# EAGLE schematic core (EAGLE 7.1.0)
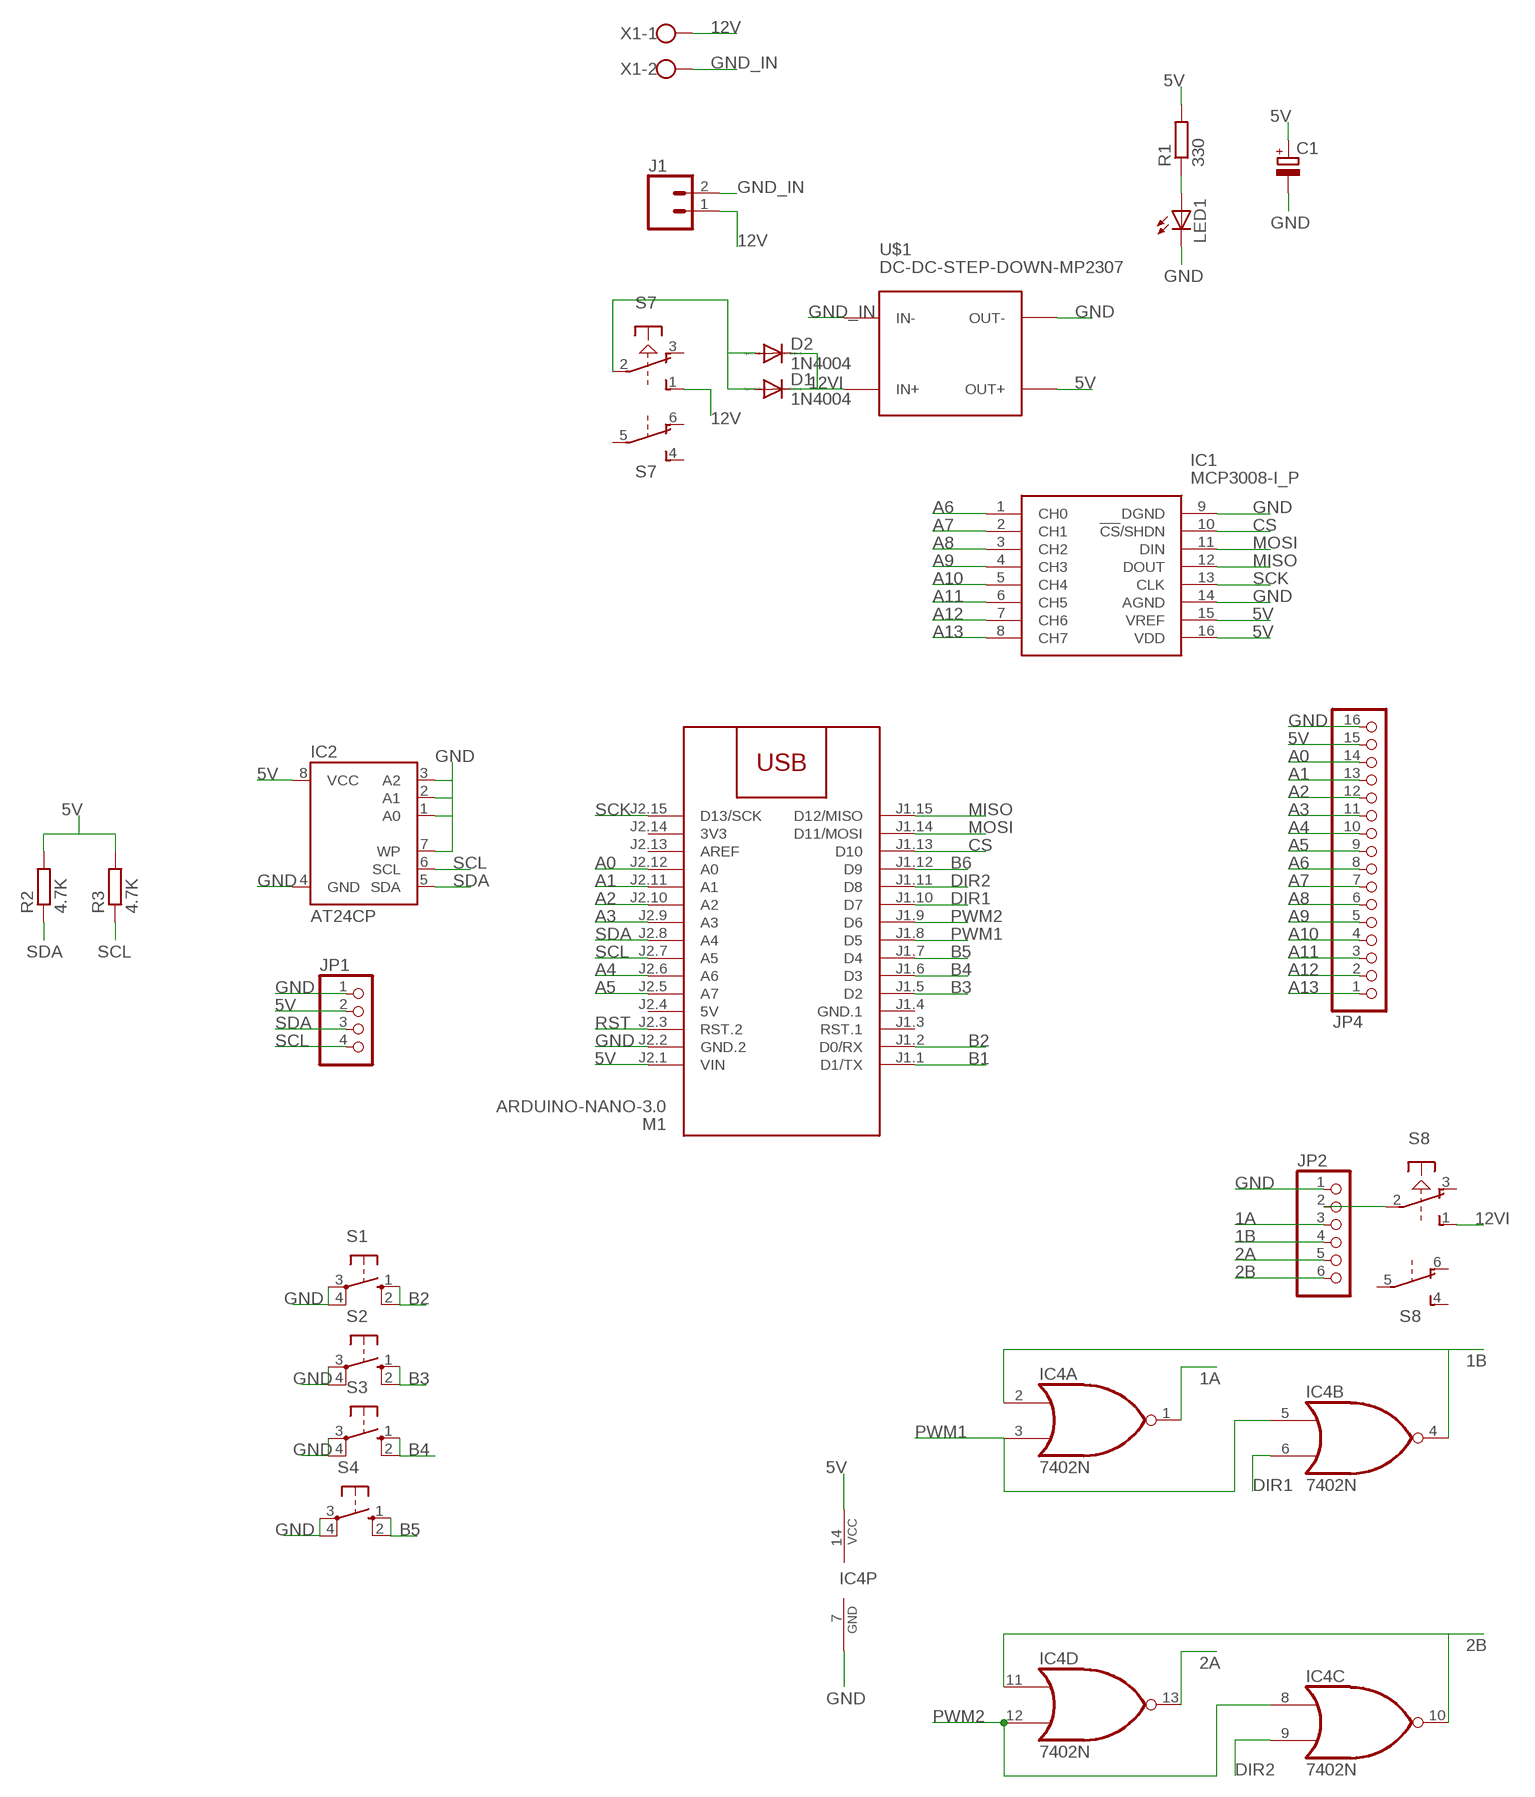
[diagram p0: schematic, sheet 1]

## Parts
C1  CPOL-EUE2.5-6  [E2,5-6]
D1  1N4004  [DO41-10]
D2  1N4004  [DO41-10]
IC1  MCP3008-I_P  [DIP781W56P254L1918H533Q16N]
IC2  AT24CP  [DIL08]
IC4  7402N  [DIL14]
J1  CONN_02POLAR  [MOLEX-1X2]
JP1  PINHD-1X4  [1X04]
JP2  PINHD-1X6  [1X06]
JP4  PINHD-1X16  [1X16]
LED1  LED3MM  [LED3MM]
M1  ARDUINO-NANO-3.0  [ARDUINO-NANO-3.0]
R1  330  R-EU_0207/7  [0207/7]
R2  4.7K  R-EU_0207/7  [0207/7]
R3  4.7K  R-EU_0207/7  [0207/7]
S1  10-XX  [B3F-10XX]
S2  10-XX  [B3F-10XX]
S3  10-XX  [B3F-10XX]
S4  10-XX  [B3F-10XX]
S7  PVA2R  [PVA2R]
S8  PVA2R  [PVA2R]
U$1  DC-DC-STEP-DOWN-MP2307  [DC-DC-STEP-DOWN-MP2307]
X1  W237-102  [W237-102]

## Nets
1A: IC4.1(A:O) JP2.3
1B: IC4.2(A:I0) IC4.4(B:O) JP2.4
2A: IC4.13(D:O) JP2.5
2B: IC4.10(C:O) IC4.11(D:I0) JP2.6
5V: C1.+ IC1.15(VREF) IC1.16(VDD) IC2.8(VCC) IC4.14(P:VCC) JP1.2 JP4.15 M1.J2.1(VIN) R1.2 R2.2 R3.2 U$1.OUT+
12V: J1.1 S7.1(1:S) X1.1
12VI: D1.C D2.C S8.1(1:S) U$1.IN+
A0: JP4.14 M1.J2.12(A0)
A1: JP4.13 M1.J2.11(A1)
A2: JP4.12 M1.J2.10(A2)
A3: JP4.11 M1.J2.9(A3)
A4: JP4.10 M1.J2.6(A6)
A5: JP4.9 M1.J2.5(A7)
A6: IC1.1(CH0) JP4.8
A7: IC1.2(CH1) JP4.7
A8: IC1.3(CH2) JP4.6
A9: IC1.4(CH3) JP4.5
A10: IC1.5(CH4) JP4.4
A11: IC1.6(CH5) JP4.3
A12: IC1.7(CH6) JP4.2
A13: IC1.8(CH7) JP4.1
B1: M1.J1.1(D1/TX)
B2: M1.J1.2(D0/RX) S1.1(S) S1.2(S1)
B3: M1.J1.5(D2) S2.1(S) S2.2(S1)
B4: M1.J1.6(D3) S3.1(S) S3.2(S1)
B5: M1.J1.7(D4) S4.1(S) S4.2(S1)
B6: M1.J1.12(D9)
CS: IC1.10(!CS!/SHDN) M1.J1.13(D10)
DIR1: IC4.6(B:I1) M1.J1.10(D7)
DIR2: IC4.9(C:I1) M1.J1.11(D8)
GND: C1.- IC1.9(DGND) IC1.14(AGND) IC2.1(A0) IC2.2(A1) IC2.3(A2) IC2.4(GND) IC2.7(WP) IC4.7(P:GND) JP1.1 JP2.1 JP4.16 LED1.K(C) M1.J2.2(GND.2) S1.3(P) S1.4(P1) S2.3(P) S2.4(P1) S3.3(P) S3.4(P1) S4.3(P) S4.4(P1) U$1.OUT-
GND_IN: J1.2 U$1.IN- X1.2
MISO: IC1.12(DOUT) M1.J1.15(D12/MISO)
MOSI: IC1.11(DIN) M1.J1.14(D11/MOSI)
N$1: D1.A D2.A S7.2(1:P)
N$2: LED1.A R1.1
N$4: JP2.2 S8.2(1:P)
PWM1: IC4.3(A:I1) IC4.5(B:I0) M1.J1.8(D5)
PWM2: IC4.8(C:I0) IC4.12(D:I1) M1.J1.9(D6)
RST: M1.J2.3(RST.2)
SCK: IC1.13(CLK) M1.J2.15(D13/SCK)
SCL: IC2.6(SCL) JP1.4 M1.J2.7(A5) R3.1
SDA: IC2.5(SDA) JP1.3 M1.J2.8(A4) R2.1
Unconnected: M1.J1.3(RST.1) M1.J2.13(AREF) S7.3(1:O) S7.4(2:S) S7.5(2:P) S7.6(2:O) S8.3(1:O) S8.4(2:S) S8.5(2:P) S8.6(2:O)

## Power pins joined to a net without a drawn wire
3V3: M1.J2.14(3V3)
5V: M1.J2.4(5V)
GND.1: M1.J1.4(GND.1)

## Library data of the parts
C1 = rcl:CPOL-EU: POLARIZED CAPACITOR, European symbol
D1 D2 = diode:1N4004: DIODE general purpose rectifier, 1 A
IC1 = MCP3008-I_P:MCP3008-I_P: 2.7V 4-Channel/8-Channel 10-Bit A/D Converterswith SPI Serial Interface Source: Datasheet <http://docs-asia.electrocomponents.com/webdocs/1380/0900766b81380acd.pdf>; ALLIED_NUMBER: 70414364; ALLIED_PRICE-STOCK: http://www.alliedelec.com/microchip-technology-inc-mcp3008-i-p/70414364/; DESCRIPTION: 2.7V 4-Channel/8-Channel 10-Bit A/D Converterswith SPI Serial Interface; HEIGHT: 5.334mm; MANUFACTURER_NAME: Microchip; MANUFACTURER_PART_NUMBER: MCP3008-I/P; MOUSER_PART_NUMBER: 579-MCP3008-I/P; MOUSER_PRICE-STOCK: https://www.mouser.com/Search/Refine.aspx?Keyword=579-MCP3008-I%2FP; RS_PART_NUMBER: 6696064P; RS_PRICE-STOCK: http://uk.rs-online.com/web/p/products/6696064P
IC2 = atmel:AT24C*: 2-wire serial EEPROM; MPN: AT24C1024BW-SH-B; OC_FARNELL: 1362646; OC_NEWARK: 03P2044
IC4 = 74xx-us:74*02: Quad 2-input NOR gate
J1 = SparkFun-Retired:CONN_02: Multi connection point. Often used as Generic Header-pin footprint for 0.1 inch spaced/style header connections On any of the 0.1 inch spaced packages, you can populate with these: Break Away Headers - Straight <https://www.sparkfun.com/products/116> (PRT-00116) Break Away Male Headers - Right Angle <https://www.sparkfun.com/products/553> (PRT-00553) Female Headers <https://www.sparkfun.com/products/115> (PRT-00115) Break Away Headers - Machine Pin <https://www.sparkfun.com/products/117> (PRT-00117) Break Away Female Headers - Swiss Machine Pin <https://www.sparkfun.com/products/743> (PRT-00743) For SCREWTERMINALS and SPRING TERMINALS visit here: Screw Terimnals on SparkFun.com <https://www.sparkfun.com/search/results?term=Screw+Terminals> (5mm/3.5mm/2.54mm spacing) This device is also useful as a general connection point to wire up your design to another part of your project. Our various solder wires solder well into these plated through hole pads. Hook-Up Wire - Assortment (Stranded, 22 AWG) <https://www.sparkfun.com/products/11375> (PRT-11375) Hook-Up Wire - Assortment (Solid Core, 22 AWG) <https://www.sparkfun.com/products/11367> (PRT-11367) View the entire wire category on our website here <https://www.sparkfun.com/categories/141> Special notes: Molex polarized connector foot print use with: PRT-08233 with associated crimp pins and housings. 2.54_SCREWTERM for use with PRT-10571. 3.5mm Screw Terminal footprints for PRT-08084 5mm Screw Terminal footprints for use with PRT-08432; SF_ID: PRT-09918
JP1 = pinhead:PINHD-1X4: PIN HEADER
JP2 = pinhead:PINHD-1X6: PIN HEADER
JP4 = pinhead:PINHD-1X16: PIN HEADER
LED1 = led:LED: LED OSRAM: - CHIPLED LG R971, LG N971, LY N971, LG Q971, LY Q971, LO R971, LY R971 LH N974, LH R974 LS Q976, LO Q976, LY Q976 LO Q996 - Hyper CHIPLED LW Q18S LB Q993, LB Q99A, LB R99A - SideLED LS A670, LO A670, LY A670, LG A670, LP A670 LB A673, LV A673, LT A673, LW A673 LH A674 LY A675 LS A676, LA A676, LO A676, LY A676, LW A676 LS A679, LY A679, LG A679 - Hyper Micro SIDELED® LS Y876, LA Y876, LO Y876, LY Y876 LT Y87S - SmartLED LW L88C, LW L88S LB L89C, LB L89S, LG L890 LS L89K, LO L89K, LY L89K LS L896, LA L896, LO L896, LY L896 - TOPLED LS T670, LO T670, LY T670, LG T670, LP T670 LSG T670, LSP T670, LSY T670, LOP T670, LYG T670 LG T671, LOG T671, LSG T671 LB T673, LV T673, LT T673, LW T673 LH T674 LS T676, LA T676, LO T676, LY T676, LB T676, LH T676, LSB T676, LW T676 LB T67C, LV T67C, LT T67C, LS T67K, LO T67K, LY T67K, LW E67C LS E67B, LA E67B, LO E67B, LY E67B, LB E67C, LV E67C, LT E67C LW T67C LS T679, LY T679, LG T679 LS T770, LO T770, LY T770, LG T770, LP T770 LB T773, LV T773, LT T773, LW T773 LH T774 LS E675, LA E675, LY E675, LS T675 LS T776, LA T776, LO T776, LY T776, LB T776 LHGB T686 LT T68C, LB T68C - Hyper Mini TOPLED® LB M676 - Mini TOPLED Santana® LG M470 LS M47K, LO M47K, LY M47K Source: http://www.osram.convergy.de LUXEON: - LUMILED® LXK2-PW12-R00, LXK2-PW12-S00, LXK2-PW14-U00, LXK2-PW14-V00 LXK2-PM12-R00, LXK2-PM12-S00, LXK2-PM14-U00 LXK2-PE12-Q00, LXK2-PE12-R00, LXK2-PE12-S00, LXK2-PE14-T00, LXK2-PE14-U00 LXK2-PB12-K00, LXK2-PB12-L00, LXK2-PB12-M00, LXK2-PB14-N00, LXK2-PB14-P00, LXK2-PB14-Q00 LXK2-PR12-L00, LXK2-PR12-M00, LXK2-PR14-Q00, LXK2-PR14-R00 LXK2-PD12-Q00, LXK2-PD12-R00, LXK2-PD12-S00 LXK2-PH12-R00, LXK2-PH12-S00 LXK2-PL12-P00, LXK2-PL12-Q00, LXK2-PL12-R00 Source: www.luxeon.com KINGBRIGHT: KA-3528ASYC Source: www.kingbright.com
M1 = diy-modules:ARDUINO-NANO-3.0: Arduino Nano 3.0 and compatible devices More details available here: https://www.arduino.cc/en/Main/ArduinoBoardNano Click here to find device on ebay.com <http://www.ebay.com/sch/arduino+nano>
R1-R3 = rcl:R-EU_: RESISTOR, European symbol
S1-S4 = switch-omron:10-XX: OMRON SWITCH; MPN: B3F-1000; OC_FARNELL: 176432; OC_NEWARK: 36M3542
S7 S8 = switch-misc:PVA2R: ITT SWITCH
U$1 = diy-modules:DC-DC-STEP-DOWN-MP2307: DC/DC Step-Down Regulator based on MP2307DN chip MP2307 datasheet available here: https://cdn-shop.adafruit.com/datasheets/MP2307_r1.9.pdf Click here to find device on ebay.com <http://www.ebay.com/sch/dc+dc+3a+mini+converter>
X1 = con-wago-500:W237-102: WAGO SCREW CLAMP; MPN: 237-102; OC_FARNELL: unknown; OC_NEWARK: 70K9898